# EAGLE design pc_healthypi_move_sensor_dual_v2 (EAGLE 9.6.2)
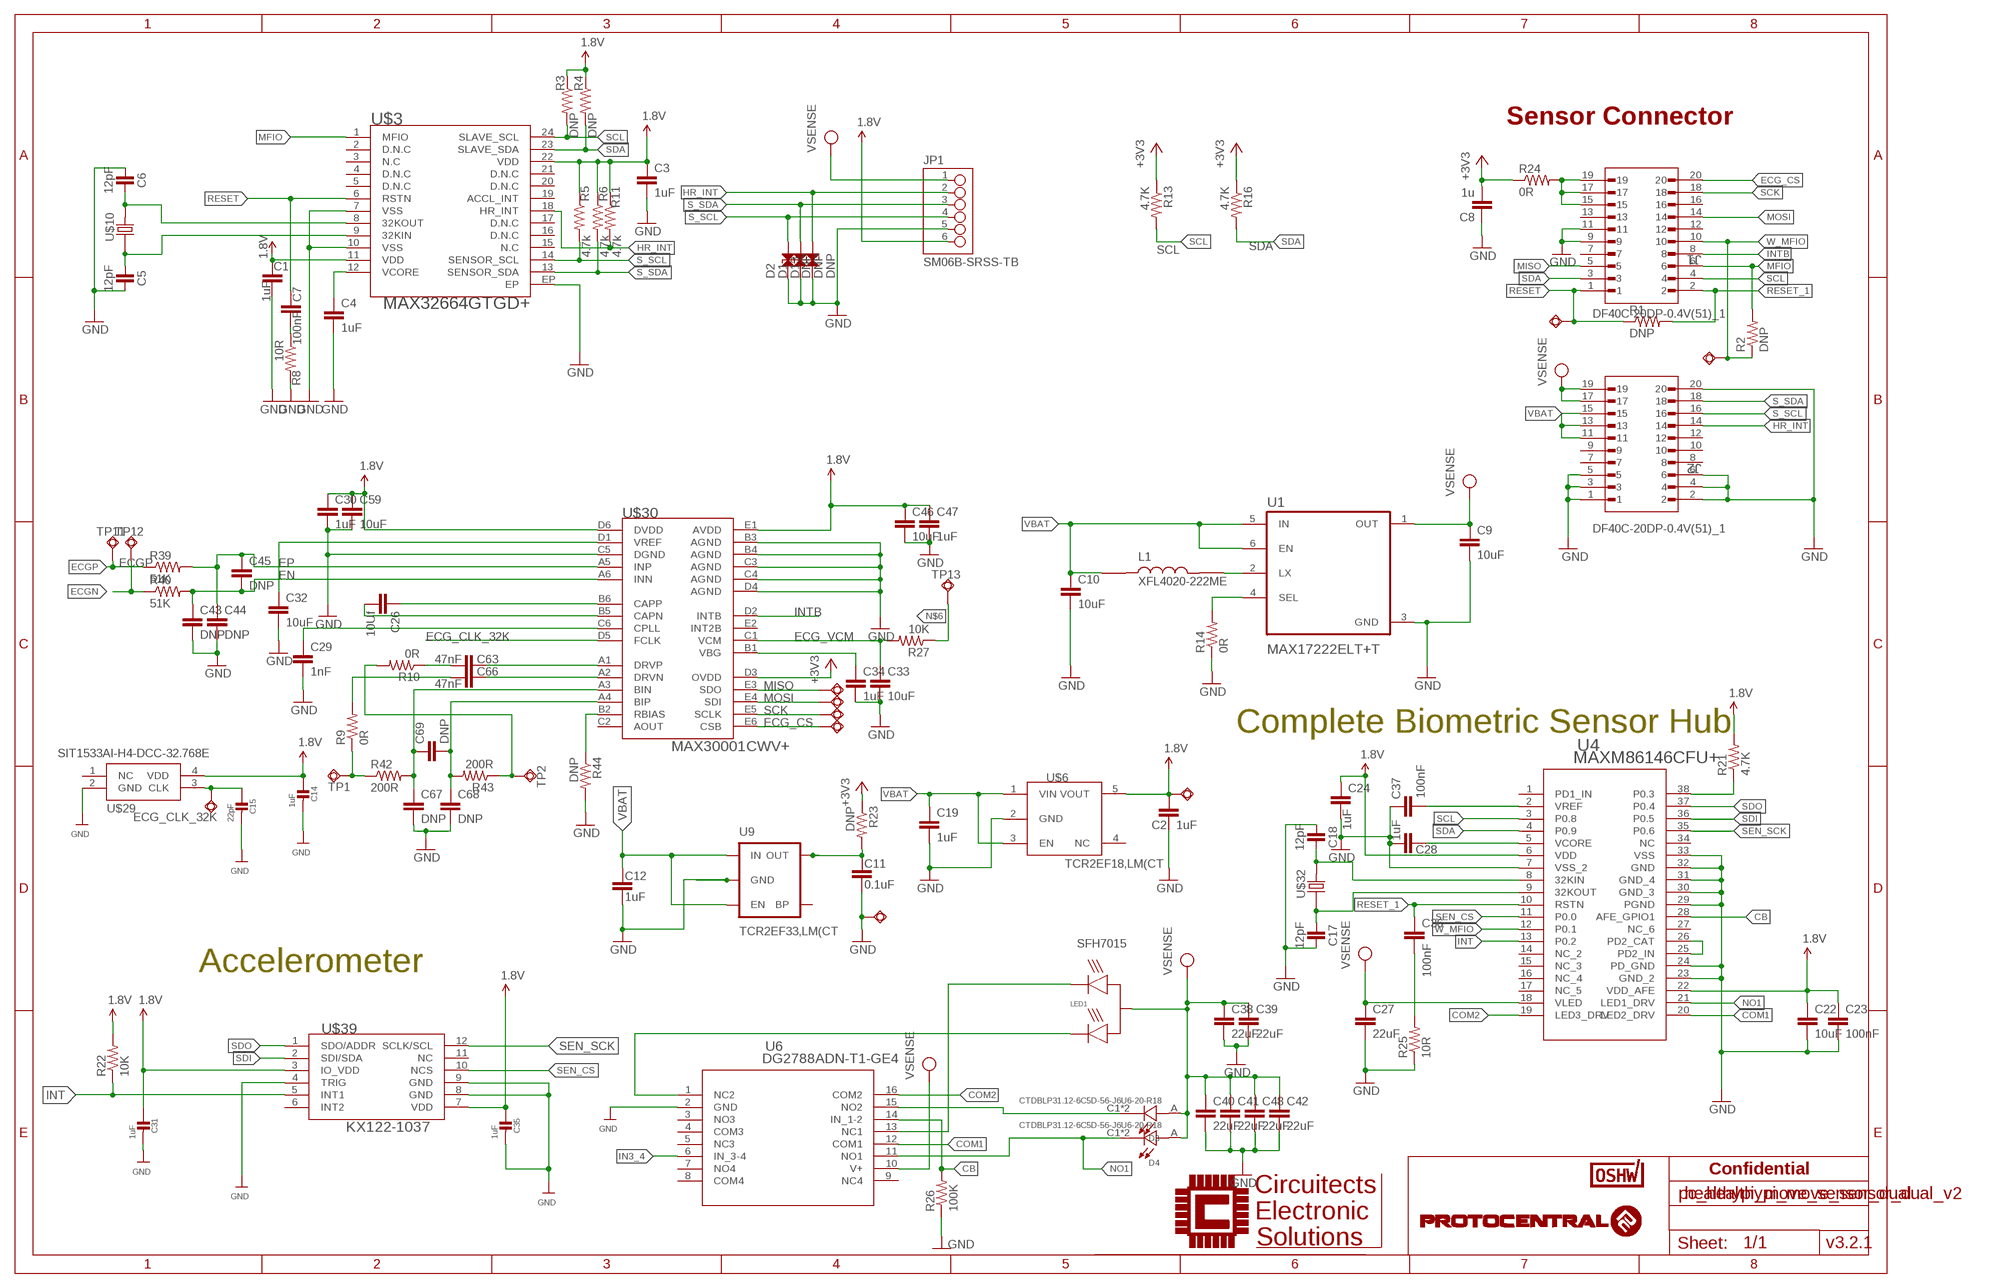
[diagram p0: schematic, sheet 1]

## Parts
C1  1uF  C-EUC0402  [C0402]
C2  1uF  C-EUC0402  [C0402]
C3  1uF  C-EUC0402  [C0402]
C4  1uF  C-EUC0402  [C0402]
C5  12pF  CAPACITORS-0402  [C0402]
C6  12pF  CAPACITORS-0402  [C0402]
C7  100nF  C-EUC0402  [C0402]
C8  1u  C-EUC0402  [C0402]
C9  10uF  C-EUC0402  [C0402]
C10  10uF  C-EUC0402  [C0402]
C11  0.1uF  0.1UF-0402-16V-10%  [0402]
C12  1uF  0.1UF-0402T-6.3V-10%-X7R  [0402-TIGHT]
C14  1uF  CAP_CERAMIC0402  [0402]
C15  22pF  CAP_CERAMIC0402  [0402]
C17  12pF  CAPACITORS-0402  [C0402]
C18  12pF  CAPACITORS-0402  [C0402]
C19  1uF  C-EUC0402  [C0402]
C22  10uF  C-EUC0402  [C0402]
C23  100nF  C-EUC0402  [C0402]
C24  1uF  C-EUC0402  [C0402]
C26  10Uf  C-EUC0402  [C0402]
C27  22uF  C-EUC0805  [C0805]
C28  1uF  C-EUC0402  [C0402]
C29  1nF  C-EUC0402  [C0402]
C30  1uF  C-EUC0402  [C0402]
C31  1uF  CAP_CERAMIC0402  [0402]
C32  10uF  C-EUC0402  [C0402]
C33  10uF  C-EUC0402  [C0402]
C34  1uF  C-EUC0402  [C0402]
C35  1uF  CAP_CERAMIC0402  [0402]
C36  100nF  C-EUC0402  [C0402]
C37  100nF  C-EUC0402  [C0402]
C38  22uF  C-EUC0805  [C0805]
C39  22uF  C-EUC0805  [C0805]
C40  22uF  C-EUC0805  [C0805]
C41  22uF  C-EUC0805  [C0805]
C42  22uF  C-EUC0805  [C0805]
C43  DNP  C-EUC0402  [C0402]
C44  DNP  C-EUC0402  [C0402]
C45  DNP  C-EUC0402  [C0402]
C46  10uF  C-EUC0402  [C0402]
C47  1uF  C-EUC0402  [C0402]
C48  22uF  C-EUC0805  [C0805]
C59  10uF  C-EUC0402  [C0402]
C63  47nF  C-EUC0402  [C0402]
C66  47nF  C-EUC0402  [C0402]
C67  DNP  C-EUC0402  [C0402]
C68  DNP  C-EUC0402  [C0402]
C69  DNP  C-EUC0402  [C0402]
D1  DNP  PESD0402-0402  [0402]
D2  DNP  PESD0402-0402  [0402]
D3  CTDBLP31.12-6C5D-56-J6U6-20-R18  [LED_CTDBLP31.12-6C5D-56-J6U6-20-R18]
D4  CTDBLP31.12-6C5D-56-J6U6-20-R18  [LED_CTDBLP31.12-6C5D-56-J6U6-20-R18]
D13  DNP  PESD0402-0402  [0402]
J1  DF40C-20DP-0.4V(51)_1  [HRS_DF40C-20DP-0.4V(51)]
J2  DF40C-20DP-0.4V(51)_1  [HRS_DF40C-20DP-0.4V(51)]
JP1  SM06B-SRSS-TB  [SM06B-SRSS-TB]
L1  XFL4020-222ME  [IND_XFL4020-222ME]
LED1  SFH7015  [SFH7015]
R1  DNP  RESISTOR0402-RES  [0402-RES]
R2  DNP  RESISTOR0402-RES  [0402-RES]
R3  DNP  RESISTOR0402-RES  [0402-RES]
R4  DNP  RESISTOR0402-RES  [0402-RES]
R5  4.7k  RESISTOR0402-RES  [0402-RES]
R6  4.7k  RESISTOR0402-RES  [0402-RES]
R8  10R  RESISTOR0402-RES  [0402-RES]
R9  0R  RESISTOR0402-RES  [0402-RES]
R10  0R  RESISTOR0402-RES  [0402-RES]
R11  4.7k  RESISTOR0402-RES  [0402-RES]
R13  4.7K  RESISTOR0402-RES  [0402-RES]
R14  0R  R-US_R0402  [R0402]
R16  4.7K  RESISTOR0402-RES  [0402-RES]
R21  4.7K  R-US_R0402  [R0402]
R22  10K  RESISTOR0402-RES  [0402-RES]
R23  DNP  RESISTOR0402-RES  [0402-RES]
R24  0R  RESISTOR0402-RES  [0402-RES]
R25  10R  R-US_R0402  [R0402]
R26  100K  R-US_R0402  [R0402]
R27  10K  R-US_R0402  [R0402]
R39  51K  RESISTOR0402-RES  [0402-RES]
R40  51K  RESISTOR0402-RES  [0402-RES]
R42  200R  RESISTOR0402-RES  [0402-RES]
R43  200R  RESISTOR0402-RES  [0402-RES]
R44  DNP  RESISTOR0402-RES  [0402-RES]
SWIO1  TPSQTP11R  [TP11R]
SWIO2  TPSQTP11R  [TP11R]
SWIO3  TPSQTP11R  [TP11R]
SWIO4  TPSQTP11R  [TP11R]
SWIO5  TPSQTP11R  [TP11R]
SWIO6  TPSQTP11R  [TP11R]
SWIO7  TPSQTP11R  [TP11R]
SWIO8  TPSQTP11R  [TP11R]
SWIO9  TPSQTP11R  [TP11R]
TP1  TPSQTP20SQ  [TP20SQ]
TP2  TPSQTP20SQ  [TP20SQ]
TP11  TPSQTP20SQ  [TP20SQ]
TP12  TPSQTP20SQ  [TP20SQ]
TP13  TPSQTP20SQ  [TP20SQ]
U1  MAX17222ELT+T  [SON65P200X200X80-6N]
U4  MAXM86146CFU+  [21-100323A_90-100112A_MXM]
U6  DG2788ADN-T1-GE4  [MINIQFN-16_VIS]
U9  TCR2EF33,LM(CT  V_REG_LDOSMD  [SOT23-5]
U$3  MAX32664GTGD+  MAX32664GTGA+  [TQFN-24L]
U$6  TCR2EF18,LM(CT  AP7354D-18W5-7  [SOT95P285X140-5N]
U$10  520-327-12.5-34B(32.768KHZ)  ECS-X-34B  [ECX-31B]
U$29  SIT1533AI-H4-DCC-32.768E  [SIT1533]
U$30  MAX30001CWV+  [30WLP]
U$32  520-327-12.5-34B(32.768KHZ)  ECS-X-34B  [ECX-31B]
U$39  KX122-1037  [KIONIX_KXTJ3-1057]
U$48  CERT-SMALL  [CERT-SMALL-SILK]

## Nets
1.8V: C1.1 C2.1 C3.1 C14.1 C22.1 C23.1 C24.1 C30.1 C31.1 C35.1 C46.1 C47.1 C59.1 JP1.6 R3.1 R4.1 R5.1 R6.1 R11.1 R21.2 R22.2 SWIO5.TP U4.6(VDD) U4.22(VDD_AFE) U$3.11(VDD) U$3.22(VDD) U$6.5(VOUT) U$29.4(VDD) U$30.D6(DVDD) U$30.E1(AVDD) U$39.3(IO_VDD) U$39.7(VDD)
+3V3: C8.2 R13.1 R16.1 R23.1 R24.1 U$30.D3(OVDD)
BIAZP: R10.2 R43.1 TP2.TP
BIOZN: R9.1 R42.1 TP1.TP
CB: R26.2 U4.28(AFE_GPIO1) U6.14(IN_1-2)
CLK_32K: C5.1 U$3.9(32KIN) U$10.P$1
CLK_32K1: C17.1 U4.9(32KOUT) U$32.P$1
COM1: U4.20(LED2_DRV) U6.12(COM1)
COM2: U4.19(LED3_DRV) U6.16(COM2)
ECG_CLK_32K: C15.1 SWIO1.TP U$29.3(CLK) U$30.D5(FCLK)
ECG_CS: J1.20 SWIO7.TP U$30.E6(CSB)
ECG_VCM: C33.1 R27.2 U$30.C1(VCM)
ECGN: R40.1 TP12.TP
ECGP: R39.1 TP11.TP
EN: C43.1 C45.2 R40.2 U$30.A6(INN)
EP: C44.1 C45.1 R39.2 U$30.A5(INP)
EXT_3V3: J1.15 J1.17 J1.19 R24.2
GND: C1.2 C2.2 C3.2 C4.2 C5.2 C6.1 C8.1 C9.2 C10.2 C11.2 C12.2 C14.2 C15.2 C17.2 C18.1 C19.2 C22.2 C23.2 C24.2 C27.2 C28.2 C29.2 C30.2 C31.2 C32.2 C33.2 C34.2 C35.2 C37.1 C38.2 C39.2 C40.2 C41.2 C42.2 C43.2 C44.2 C46.2 C47.2 C48.2 C59.2 C67.2 C68.2 D1.1 D2.1 D13.1 J1.9 J1.11 J2.1 J2.2 J2.3 J2.4 J2.5 J2.6 J2.20 JP1.5 R8.2 R14.1 R25.1 R26.1 R44.2 SWIO6.TP U1.3(GND) U4.7(VSS_2) U4.23(GND_2) U4.24(PD_GND) U4.29(PGND) U4.30(GND_3) U4.31(GND_4) U4.32(GND) U4.33(VSS) U6.2(GND) U9.2(GND) U$3.7(VSS) U$3.10(VSS) U$3.EP U$6.2(GND) U$29.2(GND) U$30.B3(AGND) U$30.B4(AGND) U$30.C3(AGND) U$30.C4(AGND) U$30.C5(DGND) U$30.D4(AGND) U$39.4(TRIG) U$39.8(GND) U$39.9(GND)
HR_INT: D13.2 J2.14 JP1.2 R11.2 U$3.18(HR_INT)
IN3_4: U6.6(IN_3-4)
INT: R22.1 U4.13(P0.2) U$39.5(INT1)
INT_3V3: C11.1 R23.2 U9.5(OUT)
INTB: J1.8 U$30.D2(INTB)
MFIO: J1.6 R2.2 U$3.1(MFIO)
MISO: J1.5 SWIO2.TP U$30.E3(SDO)
MOSI: J1.14 SWIO3.TP U$30.E4(SDI)
N$1: C4.1 U$3.12(VCORE)
N$2: C7.2 R8.1
N$3: R14.2 U1.4(SEL)
N$4: L1.2 U1.2(LX)
N$5: C18.2 U4.8(32KIN) U$32.P$2
N$6: R27.1 TP13.TP
N$8: U4.25(PD2_IN) U4.26(PD2_CAT)
N$9: C28.1 U4.5(VCORE)
N$10: R21.1 U4.38(P0.3)
N$11: C37.2 U4.2(VREF)
N$12: C36.2 R25.2
N$18: C66.1 R9.2
N$19: C63.1 R10.1
N$21: LED1.4(IRC) U6.13(NC1)
N$23: LED1.2(RC) U6.1(NC2)
N$25: C6.2 U$3.8(32KOUT) U$10.P$2
N$26: D3.C1(C) D3.C2(C) U6.15(NO2)
N$53: C29.1 U$30.C6(CPLL)
N$55: C26.2 U$30.B5(CAPN)
N$56: C32.1 U$30.D1(VREF)
N$57: C34.1 U$30.B1(VBG)
N$60: C26.1 U$30.B6(CAPP)
N$61: C63.2 U$30.A1(DRVP)
N$62: C66.2 U$30.A2(DRVN)
N$63: C67.1 C69.1 R42.2 U$30.A3(BIN)
N$64: C68.1 C69.2 R43.2 U$30.A4(BIP)
N$65: R44.1 U$30.B2(RBIAS)
NO1: D4.C1(C) D4.C2(C) U4.21(LED1_DRV) U6.11(NO1)
RESET: C7.1 J1.1 R1.1 SWIO8.TP U$3.6(RSTN)
RESET_1: C36.1 J1.2 R1.2 U4.10(RSTN)
S_SCL: D2.2 J2.16 JP1.4 R5.2 U$3.14(SENSOR_SCL)
S_SDA: D1.2 J2.18 JP1.3 R6.2 U$3.13(SENSOR_SDA)
SCK: J1.18 SWIO4.TP U$30.E5(SCLK)
SCL: J1.4 R3.2 R13.2 U4.3(P0.8) U$3.24(SLAVE_SCL)
SDA: J1.3 R4.2 R16.2 U4.4(P0.9) U$3.23(SLAVE_SDA)
SDI: U4.36(P0.5) U$39.2(SDI/SDA)
SDO: U4.37(P0.4) U$39.1(SDO/ADDR)
SEN_CS: U4.11(P0.0) U$39.10(NCS)
SEN_SCK: U4.35(P0.6) U$39.12(SCLK/SCL)
VBAT: C10.1 C12.1 C19.1 J2.11 J2.13 J2.15 L1.1 U1.5(IN) U1.6(EN) U9.1(IN) U9.3(EN) U$6.1(VIN) U$6.3(EN)
VPP: C9.1 C27.1 C38.1 C39.1 C40.1 C41.1 C42.1 C48.1 D3.A D4.A J2.17 J2.19 JP1.1 LED1.3(A) U1.1(OUT) U4.18(VLED) U6.10(V+) ; supply symbol labelled VSENSE
W_MFIO: J1.10 R2.1 SWIO9.TP U4.12(P0.1)
Unconnected: J1.7 J1.12 J1.13 J1.16 J2.7 J2.8 J2.9 J2.10 J2.12 U4.1(PD1_IN) U4.14(NC_2) U4.15(NC_3) U4.16(NC_4) U4.17(NC_5) U4.27(NC_6) U4.34(NC) U6.3(NO3) U6.4(COM3) U6.5(NC3) U6.7(NO4) U6.8(COM4) U6.9(NC4) U9.4(BP) U$3.2(D.N.C) U$3.3(N.C) U$3.4(D.N.C) U$3.5(D.N.C) U$3.15(N.C) U$3.16(D.N.C) U$3.17(D.N.C) U$3.19(ACCL_INT) U$3.20(D.N.C) U$3.21(D.N.C) U$6.4(NC) U$29.1(NC) U$30.C2(AOUT) U$30.E2(INT2B) U$39.6(INT2) U$39.11(NC)

## Notes on the sheet
- Sensor Connector
- Complete Biometric Sensor Hub
- SFH7015
- Accelerometer
- Confidential
- healthypi_move_sensor_dual
- v3.2.1

## Library data of the parts
C1-C4 C7-C10 C19 C22-C24 C26-C30 C32-C34 C36-C48 C59 C63 C66-C69 = rcl:C-EU: CAPACITOR, European symbol; SPICEPREFIX: C
C5 C6 C17 C18 = Arduino:CAPACITORS: Capacitors ...4.7uF @ 6.3V -> 0402 ...10uF @ 16V -> 0603 ...22uF @ 25V -> 0805
C11 = SparkFun-Capacitors:0.1UF: 0.1µF ceramic capacitors A capacitor is a passive two-terminal electrical component used to store electrical energy temporarily in an electric field.; PROD_ID: CAP-12416
C12 = SparkFun-Capacitors:0.1UF: 0.1µF ceramic capacitors A capacitor is a passive two-terminal electrical component used to store electrical energy temporarily in an electric field.; PROD_ID: CAP-14993; VALUE: 0.1uF
C14 C15 C31 C35 = microbuilder:CAP_CERAMIC: Ceramic Capacitors 0402 - 0402 Surface Mount Capacitors 16pF 50V 5% [Digikey: 445-4899-2-ND] 18pF 50V 5% [Digikey: 490-1281-2-ND] 22pF 50V 5% [Digikey: 490-1283-2-ND] 68pF 50V 5% [Digikey: 490-1289-2-ND] 0.1uF 10V 10% [Digikey: 490-1318-2-ND] 1.0uF 6.3V 10% [Digikey: 490-1320-2-ND] 0603 - 0603 Surface Mount Capacitors 16 pF 50V 5% [Digikey: 445-5051-2-ND] 22 pF 50V [Digikey: PCC220ACVTR-ND] 33 pF 50V 5% [Digikey: 490-1415-1-ND] 56pF 50V 5% [Digikey: 490-1421-1-ND] 220pF 50V 5% [Digikey: 445-1285-1-ND] 680 pF 50V 2200 pF 50V 5% C0G [Digikey: 445-1297-1-ND] 5600 pF 100V 5% X7R [Digikey: 478-3711-1-ND] 0.1 µF 25V 10% [Digikey: PCC2277TR-ND] 0.22 µF 16V 10% X7R [Digikey: 445-1318-1-ND] 1.0 µF 25V 10% [Digikey: 445-5146-2-ND] 0603 - RF Specific 3pF 250V +/-0.1pF RF [Digikey: 712-1347-1-ND] 18 pF 250V 5% [Digikey: 478-3505-1-ND or 712-1322-1-ND] 56 pF 250V 5% C0G RF [Digikey: 490-4867-1-ND] 68 pF 250V RF [Digikey: 490-4868-1-ND] 0805 - 0805 Surface Mount Capacitors 220 pF 250V 2% RF Ceramic Capacitor [Digikey: 712-1398-1-ND] 1000 pF 50V 2% NP0 Ceramic Capacitor [Digikey: 478-3760-1-ND] 0.1 µF 25V 10% Ceramic Capacitor [Digikey: PCC1828TR-ND] 1.0 µF 16V 10% Ceramic Capacitor[Digikey: 490-1691-2-ND] 10.0 µF 10V 10% Ceramic Capacitor[Digikey: 709-1228-1-ND] 10.0 uF 16V 10% Ceramic Capacitor [Digikey: 478-5165-2-ND] 47 uF 6.3V 20% Ceramic Capacitor [Digikey: 587-1779-1-ND or 399-5506-1-ND] 1206 - 1206 Surface Mount Capacitors 47uF 10V 20% Ceramic Capacitor [Digikey: 490-5528-1-ND or 399-5508-1-ND or 445-6010-1-ND]
D1 D2 D13 = SparkFun-DiscreteSemi:PESD0402: ESD protection diode PESD is used to protect a signal line from ESD.; DIGIKEY_PART: PESD0402-140CT-ND; MOUSE_PART: 650-PESD0402-140; PROD_ID: DIO-15359
D3 D4 = circuitects:CTDBLP31.12-6C5D-56-J6U6-20-R18: Standard LEDs - SMD Green 536nm Firefly E2218 Check availability <https://pricing.snapeda.com/parts/CT%20DBLP31.12-6C5D-56-J6U6-20-R18/OSRAM%20Opto%20Semiconductors/view-part?ref=eda>; AVAILABILITY: In Stock; DESCRIPTION: Standard LEDs - SMD Green 536nm Firefly E2218; MF: OSRAM Opto Semiconductors; MP: CT DBLP31.12-6C5D-56-J6U6-20-R18; PACKAGE: None; PRICE: None; PURCHASE-URL: https://pricing.snapeda.com/search/part/CT DBLP31.12-6C5D-56-J6U6-20-R18/?ref=eda
J1 J2 = circuitects:DF40C-20DP-0.4V(51)_1; MANUFACTURER: Hirose Electric; MAXIMUM_PACKAGE_HEIGHT: 1.29mm; PARTREV: 02/2020; STANDARD: Manufacturer Recommendations
JP1 = circuitects:SM06B-SRSS-TB: Check availability <https://pricing.snapeda.com/parts/SM06B-SRSS-TB/JST%20Sales/view-part?ref=eda>; AVAILABILITY: In Stock; CHECK_PRICES: https://www.snapeda.com/parts/SM06B-SRSS-TB/JST+Sales+America+Inc./view-part/?ref=eda; DESCRIPTION: Connector Header Surface Mount, Right Angle 6 position 0.039 (1.00mm); MF: JST Sales; MP: SM06B-SRSS-TB; PACKAGE: None; PRICE: None; PURCHASE-URL: https://www.snapeda.com/api/url_track_click_mouser/?unipart_id=555083&manufacturer=JST Sales&part_name=SM06B-SRSS-TB&search_term=sm06b-srss-tb; SNAPEDA_LINK: https://www.snapeda.com/parts/SM06B-SRSS-TB/JST+Sales+America+Inc./view-part/?ref=snap
L1 = circuitects:XFL4020-222ME: Power inductor, shielded, 20% tol, SMT, RoHS, halogen free Check availability <https://pricing.snapeda.com/parts/XFL4020-222ME/Coilcraft/view-part?ref=eda>; AVAILABILITY: In Stock; CHECK_PRICES: https://www.snapeda.com/parts/XFL4020-222ME/Coilcraft/view-part/?ref=eda; DESCRIPTION: Power inductor, shielded, 20% tol, SMT, RoHS, halogen free; MF: Coilcraft; MP: XFL4020-222ME; PACKAGE: None; PRICE: None; SNAPEDA_LINK: https://www.snapeda.com/parts/XFL4020-222ME/Coilcraft/view-part/?ref=snap
LED1 = circuitects:SFH7015: Check availability <https://pricing.snapeda.com/parts/SFH%207015/OSRAM%20Opto%20Semiconductors/view-part?ref=eda>; AVAILABILITY: In Stock; DESCRIPTION: Infrared (IR) Emitter 950nm 1.3V 60mA 1.65mW/sr @ 20mA 120° 4-SMD, No Lead; MF: OSRAM Opto Semiconductors; MP: SFH 7015; PACKAGE: None; PRICE: None; PURCHASE-URL: https://pricing.snapeda.com/search/part/SFH 7015/?ref=eda
R1-R6 R8-R11 R13 R16 R22-R24 R39 R40 R42-R44 = SparkFun:RESISTOR: Resistor Basic schematic elements and footprints for 0603, 1206, and PTH resistors.
R14 R21 R25-R27 = rcl:R-US_: RESISTOR, American symbol; SPICEPREFIX: R
SWIO1-SWIO9 TP1 TP2 TP11-TP13 = testpad:TPSQ: Test pad
U1 = circuitects:MAX17222ELT+T: Check availability <https://pricing.snapeda.com/parts/MAX17222ELT%2BT/Analog%20Devices/view-part?ref=eda>; AVAILABILITY: In Stock; CHECK_PRICES: https://www.snapeda.com/parts/MAX17222ELT+T/Analog+Devices/view-part/?ref=eda; DESCRIPTION: 400mV to 5.5V Input, nanoPower Synchronous Boost Converter with True Shutdown; MF: Analog Devices; MP: MAX17222ELT+T; PACKAGE: uDFN-6 Maxim; PRICE: None; PURCHASE-URL: https://www.snapeda.com/api/url_track_click_mouser/?unipart_id=2779660&manufacturer=Analog Devices&part_name=MAX17222ELT+T&search_term= max17222elt+t; SNAPEDA_LINK: https://www.snapeda.com/parts/MAX17222ELT+T/Analog+Devices/view-part/?ref=snap
U4 = circuitects:MAXM86146CFU+; COPYRIGHT: Copyright (C) 2023 Ultra Librarian. All rights reserved.; MANUFACTURER_PART_NUMBER: MAXM86146CFU+; MFR_NAME: Analog Devices / Maxim Integrated
U6 = circuitects:DG2788ADN-T1-GE4; COPYRIGHT: Copyright (C) 2023 Ultra Librarian. All rights reserved.; MANUFACTURER_PART_NUMBER: DG2788ADN-T1-GE4; MFR_NAME: Vishay
U9 = SparkFun-PowerIC:V_REG_LDO: Voltage Regulator LDO Standard 150mA LDO voltage regulator in SOT-23 layout. Micrel part MIC5205. BP (by-pass) pin is used to lower output noise with 470pF cap.; PROD_ID: VREG-12457
U$3 = circuitects:MAX32664GTGA+
U$6 = circuitects:AP7354D-18W5-7
U$10 U$32 = circuitects:ECS-X-34B
U$29 = circuitects:SIT1533AI-H4-DCC-32.768E
U$30 = circuitects:MAX30001CWV+
U$39 = KIONIX_KXTJ3-1057:KX122-1037
U$48 = OSHWA:CERT

## Net classes
2 Clock: width 0.089 mm, clearance 0.178 mm

## Board
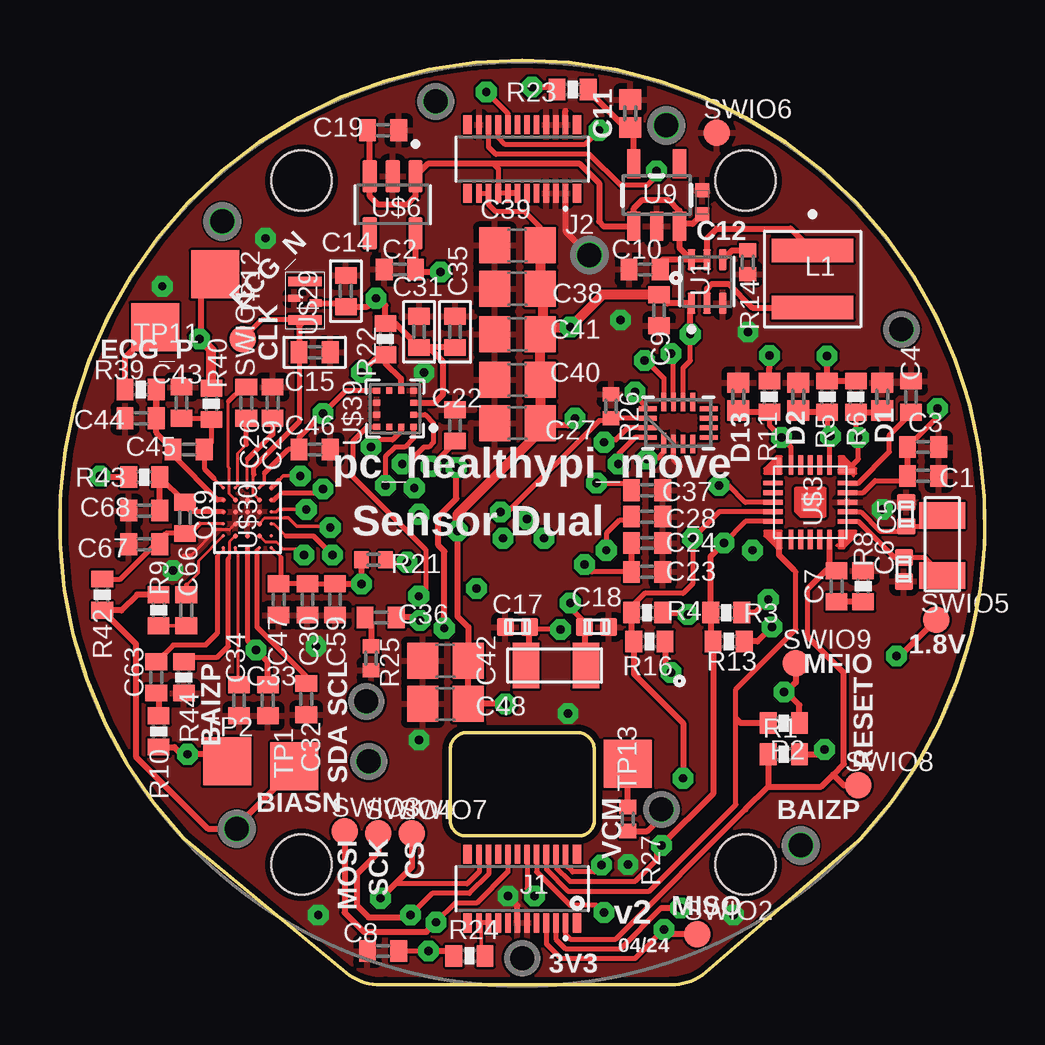
[diagram p1: board, top side]
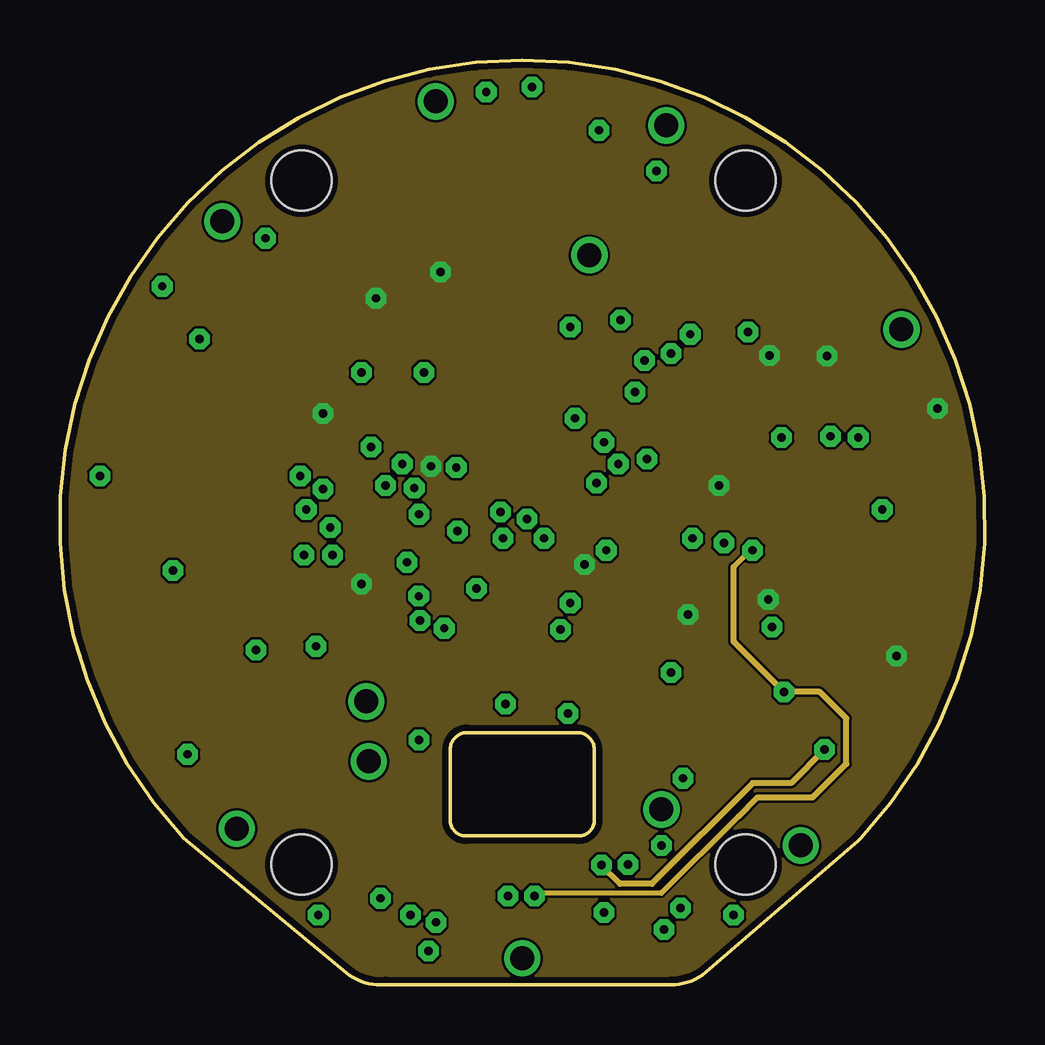
[diagram p2: board, inner layer Route2]
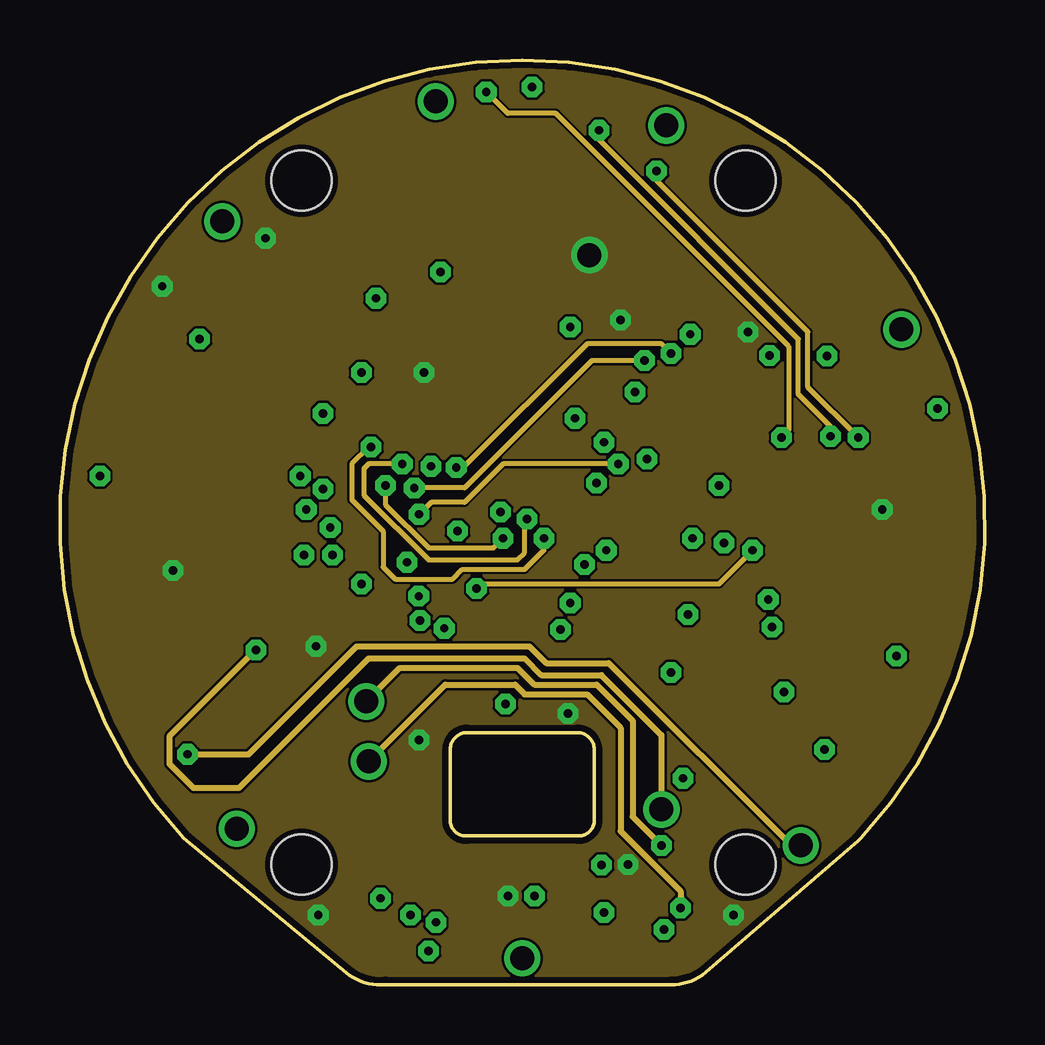
[diagram p3: board, inner layer Route15]
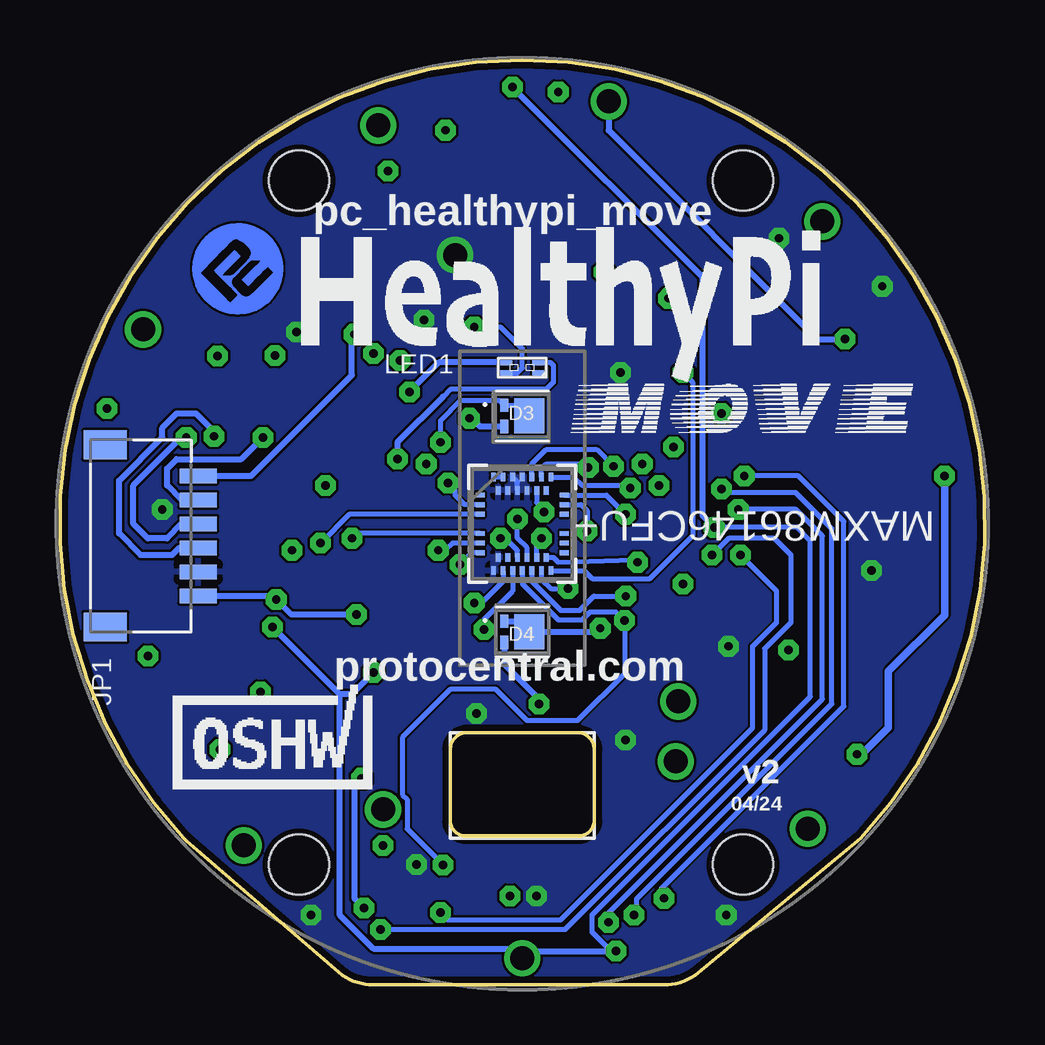
[diagram p4: board, bottom side, seen from below]

Size 38.52 x 38.54 mm. Coordinates in mm from the lower left corner, seen from the top.
Outline: 13.56,0.01 25.46,0.01 arc37 26.76,0.41 33.26,6.01 arc4 33.36,6.11 arc266 5.16,6.11 12.06,0.41 arc42 13.56,0.01
Outline: 16.96,10.51 21.56,10.51 arc-90 22.26,9.81 22.26,6.81 arc-90 21.56,6.21 16.96,6.21 arc-90 16.26,6.81 16.26,9.81 arc-90 16.96,10.51
Copper layers (1+2*15+16): Top 0.035mm / dielectric 0.26mm / Route2 0.035mm / dielectric 0.2mm / Route15 0.035mm / dielectric 0.2mm / Bottom 0.035mm
Design rules "Circuitects-Rules *": minimum track width 3mil, minimum drill 0.3mm, track to track 4mil, track to pad 4mil, pad to pad 6mil, via to via 6mil, smd to smd 4mil, copper to edge 10mil, drill to drill 8mil, minimum pad ring 12mil, minimum via ring 10mil, stop-mask expansion 4mil, vias tented up to drill 25mil, thermal gap 10mil
Holes 2.5 mm at 10.06,33.51 28.56,33.51 10.06,5.01 28.56,5.01

### Footprints (pad centres in the part's own frame; a part is rotated, then mirrored left to right if it is on the bottom)
C0402 = smd 0.7 x 0.9: 1 -0.65,0; 2 0.65,0
C0402' = smd 0.75 x 0.7: 1 0,0.5; 2 0,-0.5
0402 = smd 0.85 x 0.9: 1 -0.58,0; 2 0.58,0
0402-TIGHT = smd 0.6 x 0.6: 1 -0.5,0; 2 0.5,0
0402' = smd 0.7 x 0.9: 1 -0.65,0; 2 0.65,0
C0805 = smd 1.3 x 1.5: 1 -0.95,0; 2 0.95,0
LED_CTDBLP31.12-6C5D-56-J6U6-20-R18 = smd 0.35 x 0.55: A -0.75,-0.445; C1 -0.75,0.445 | smd 1.25 x 1.45: C2 0.3,0
HRS_DF40C-20DP-0.4V(51) = smd 0.23 x 0.8: 1 -1.8,1.43; 2 -1.8,-1.43; 3 -1.4,1.43; 4 -1.4,-1.43; 5 -1,1.43; 6 -1,-1.43; 7 -0.6,1.43; 8 -0.6,-1.43; 9 -0.2,1.43; 10 -0.2,-1.43; 11 0.2,1.43; 12 0.2,-1.43; 13 0.6,1.43; 14 0.6,-1.43; 15 1,1.43; 16 1,-1.43; 17 1.4,1.43; 18 1.4,-1.43; 19 1.8,1.43; 20 1.8,-1.43 | smd 0.35 x 0.8: S1 -2.275,1.43; S2 -2.275,-1.43; S3 2.275,1.43; S4 2.275,-1.43
SM06B-SRSS-TB = smd 0.6 x 1.55: 1 -2.5,0; 2 -1.5,0; 3 -0.5,0; 4 0.5,0; 5 1.5,0; 6 2.5,0 | smd 1.2 x 1.8: P-MOUNT1 -3.8,-3.875; P-MOUNT2 3.8,-3.875
IND_XFL4020-222ME = smd 0.98 x 3.4: 1 -1.185,0; 2 1.185,0
SFH7015 = smd 0.5 x 0.25: 1 0.675,-0.225; 2 0.675,0.225; 3 -0.675,-0.225; 4 -0.675,0.225
0402-RES = smd 0.7 x 0.9: 1 -0.65,0; 2 0.65,0
R0402 = smd 0.6 x 0.7: 1 -0.5,0; 2 0.5,0
TP11R = smd 1.1 x 1.1: TP 0,0
TP20SQ = smd 2 x 2: TP 0,0
SON65P200X200X80-6N = smd 0.88 x 0.32: 1 -0.91,0.65; 2 -0.91,0; 3 -0.91,-0.65; 4 0.91,-0.65; 5 0.91,0; 6 0.91,0.65
21-100323A_90-100112A_MXM = smd 0.356 x 0.2: 1 -1.75,1.2; 2 -1.75,0.8; 3 -1.75,0.4; 4 -1.75,-0.4; 5 -1.75,-0.8; 6 -1.75,-1.2; 14 1.75,-1.2; 15 1.75,-0.8; 16 1.75,-0.4; 17 1.75,0.4; 18 1.75,0.8; 19 1.75,1.2 | smd 0.2 x 0.356: 7 -1.2,-1.95; 8 -0.8,-1.95; 9 -0.4,-1.95; 10 0,-1.95; 11 0.4,-1.95; 12 0.8,-1.95; 13 1.2,-1.95; 20 1.2,1.95; 21 0.8,1.95; 22 0.4,1.95; 23 0,1.95; 24 -0.4,1.95; 25 -0.8,1.95; 26 -1.2,1.95; 27 1,1.395; 28 0.6,1.395; 29 0.2,1.395; 30 -0.2,1.395; 31 -0.6,1.395; 32 -1,1.395; 33 -1,-1.395; 34 -0.6,-1.395; 35 -0.2,-1.395; 36 0.2,-1.395; 37 0.6,-1.395; 38 1,-1.395
MINIQFN-16_VIS = smd 0.864 x 0.203: 1 -0.826,0.6 | smd 0.762 x 0.203: 2 -0.876,0.2; 3 -0.876,-0.2; 4 -0.876,-0.6; 9 0.876,-0.6; 10 0.876,-0.2; 11 0.876,0.2; 12 0.876,0.6 | smd 0.203 x 0.762: 5 -0.6,-1.27; 6 -0.2,-1.27; 7 0.2,-1.27; 8 0.6,-1.27; 13 0.6,1.27; 14 0.2,1.27; 15 -0.2,1.27; 16 -0.6,1.27
SOT23-5 = smd 0.55 x 1.2: 1 -0.95,-1.3; 2 0,-1.3; 3 0.95,-1.3; 4 0.95,1.3; 5 -0.95,1.3
TQFN-24L = smd 0.7 x 0.2: 1 -1.6,1.3; 7 -1.5,-1.3; 19 1.5,1.3 | smd 0.8 x 0.2: 2 -1.55,0.8; 3 -1.55,0.4; 4 -1.55,0; 5 -1.55,-0.4; 6 -1.55,-0.8; 14 1.55,-0.8; 15 1.55,-0.4; 16 1.55,0; 17 1.55,0.4; 18 1.55,0.8 | smd 0.2 x 0.8: 8 -0.8,-1.55; 9 -0.4,-1.55; 10 0,-1.55; 11 0.4,-1.55; 12 0.8,-1.55; 20 0.8,1.55; 21 0.4,1.55; 22 0,1.55; 23 -0.4,1.55; 24 -0.8,1.55 | smd 0.2 x 0.7: 13 1.3,-1.5 | smd 0.7 x 0.7: EP 0,0
SOT95P285X140-5N = smd 1.35 x 0.6: 1 -1.185,0.95; 2 -1.185,0; 3 -1.185,-0.95; 4 1.185,-0.95; 5 1.185,0.95
ECX-31B = smd 1.1 x 1.9: P$1 1.25,0; P$2 -1.25,0
SIT1533 = smd 0.4 x 1.4: 1 -0.8,0; 3 0.8,0 | smd 0.3 x 0.5: 2 -0.1,-0.45; 4 0.1,0.45
30WLP = smd 0.15 x 0.15: A1 -1.25,1; A2 -0.75,1; A3 -0.25,1; A4 0.25,1; A5 0.75,1; A6 1.25,1; B1 -1.25,0.5; B6 1.25,0.5; C1 -1.25,0; C6 1.25,0; D1 -1.25,-0.5; D6 1.25,-0.5; E1 -1.25,-1; E2 -0.75,-1; E3 -0.25,-1; E4 0.25,-1; E5 0.75,-1; E6 1.25,-1 | smd 0.2 x 0.2: B2 -0.75,0.5; B3 -0.25,0.5; B4 0.25,0.5; B5 0.75,0.5; C2 -0.75,0; C3 -0.25,0; C4 0.25,0; C5 0.75,0; D2 -0.75,-0.5; D3 -0.25,-0.5; D4 0.25,-0.5; D5 0.75,-0.5
KIONIX_KXTJ3-1057 = smd 0.275 x 0.25: 1 -0.762,0.75; 2 -0.762,0.25; 3 -0.762,-0.25; 4 -0.762,-0.75; 7 0.762,-0.75; 8 0.762,-0.25; 9 0.762,0.25; 10 0.762,0.75 | smd 0.25 x 0.275: 5 -0.25,-0.762; 6 0.25,-0.762; 11 0.25,0.762; 12 -0.25,0.762

### Placement (x,y rotation side)
C1  35.96,21.21 0 top
C2  14.16,29.81 180 top
C3  35.96,22.41 0 top
C4  35.46,24.51 90 top
C5  12pF  [C0402']  35.26,19.61 180 top
C6  12pF  [C0402']  35.16,17.31 180 top
C7  32.36,16.61 270 top
C8  13.46,1.41 0 top
C9  24.96,28.11 270 top
C10  24.36,29.81 180 top
C11  23.76,36.31 90 top
C12  26.76,32.61 90 top
C14  1uF  [0402']  11.91,28.91 90 top
C15  22pF  [0402']  10.61,26.36 0 top
C17  12pF  [C0402']  19.06,14.91 270 top
C18  12pF  [C0402']  22.36,14.91 270 top
C19  13.46,35.61 0 top
C22  16.46,23.31 90 top
C23  24.46,17.21 0 top
C24  24.46,18.41 0 top
C26  7.76,24.26 90 top
C27  19.06,23.41 180 top
C28  24.46,19.51 0 top
C29  8.86,24.26 90 top
C30  10.31,16.06 270 top
C31  1uF  [0402']  14.96,27.21 90 top
C32  10.26,11.91 270 top
C33  8.66,11.86 270 top
C34  7.46,11.86 270 top
C35  1uF  [0402']  16.46,27.21 90 top
C36  13.36,15.31 180 top
C37  24.46,20.61 180 top
C38  19.06,29.01 180 top
C39  19.06,30.81 180 top
C40  19.06,25.21 180 top
C41  19.06,27.11 180 top
C42  16.06,13.51 180 top
C43  5.06,24.26 90 top
C44  3.36,23.61 180 top
C45  5.36,22.31 0 top
C46  10.61,22.31 0 top
C47  9.11,16.06 270 top
C48  16.06,11.71 180 top
C59  11.46,16.06 270 top
C63  4.01,12.81 90 top
C66  5.26,15.61 90 top
C67  3.51,18.36 180 top
C68  3.51,19.76 180 top
C69  5.21,19.46 90 top
D1  34.26,24.51 270 top
D2  30.76,24.51 270 top
D3  19.26,23.71 0 bottom
D4  19.26,14.71 0 bottom
D13  28.26,24.51 270 top
J1  19.26,4.01 180 top
J2  19.26,34.41 180 top
JP1  32.76,18.71 270 bottom
L1  31.36,29.41 270 top
LED1  19.26,25.71 0 bottom
R1  30.16,9.61 0 top
R2  30.16,10.91 180 top
R3  27.76,15.51 180 top
R4  24.46,15.51 180 top
R5  31.96,24.51 270 top
R6  33.16,24.51 270 top
R8  33.46,16.61 90 top
R9  4.11,15.61 270 top
R10  4.11,10.56 270 top
R11  29.56,24.51 270 top
R13  27.86,14.31 180 top
R14  28.66,30.11 90 top
R16  24.56,14.31 180 top
R21  13.06,17.71 180 top
R22  13.56,26.91 90 top
R23  21.36,37.31 0 top
R24  17.06,1.21 0 top
R25  12.96,13.61 90 top
R26  22.96,24.11 270 top
R27  23.66,6.91 270 top
R39  3.36,24.81 0 top
R40  6.31,24.21 270 top
R42  1.76,16.26 90 top
R43  3.51,21.16 0 top
R44  5.16,12.81 270 top
SWIO1  7.61,26.91 270 top
SWIO2  26.56,2.11 0 top
SWIO3  11.86,6.41 0 top
SWIO4  13.26,6.31 0 top
SWIO5  36.51,15.21 0 top
SWIO6  27.36,35.51 0 top
SWIO7  14.66,6.31 0 top
SWIO8  33.26,8.31 0 top
SWIO9  30.66,13.41 0 top
TP1  9.76,9.11 0 top
TP2  6.96,9.31 0 top
TP11  3.96,27.41 270 top
TP12  6.46,29.61 270 top
TP13  23.66,9.21 270 top
U1  26.96,29.31 90 top
U4  19.26,19.21 0 bottom
U6  25.76,23.41 90 top
U9  24.86,32.91 0 top
U$3  31.26,20.11 90 top
U$6  13.86,32.51 270 top
U$10  36.76,18.31 90 top
U$23  [HEALTHYPI_MOVE_LOGO_1]  18.06,20.41 0 bottom
U$24  [HEALTHYPI_MOVE_LOGO]  28.46,21.81 0 bottom
U$29  10.21,28.51 270 top
U$30  7.81,19.46 90 top
U$32  20.66,13.31 180 top
U$39  13.96,24.01 180 top
U$48  29.66,8.16 0 bottom
U$52  [PCROUNDLOGO_GOLD]  28.86,27.01 90 bottom

### Tracks (layer width: path | path; a pad name or v marks a point on that pad's centre or on a via)
1.8V  (via drill 0.35)
  Top 0.127: U$30.E1 9.21,17.81
  Top 0.152: U$30.D6 8.51,20.91 8.51,21.31
  Top 0.2: 8.51,21.31 9.51,22.31 C46.1 9.96,22.81 v10.96,23.81 11.91,24.76 U$39.7 | 9.21,17.81 9.21,16.81 C47.1 C30.1 C59.1 | U$3.11 33.46,20.51 33.96,21.01 35.11,21.01 C1.1 | U$3.22 28.56,20.11 27.86,20.81 v27.46,20.81 | C22.1 16.46,22.61 v15.46,21.61 | v21.86,17.51 22.16,17.21 23.51,17.21 23.81,17.51 C24.1 | C3.1 36.66,23.76 36.66,23.91 v36.56,24.01
  Top 0.254: U$6.5 C2.1 14.91,29.71 v15.86,29.71 | U$29.4 11.76,28.41 C14.1 12.81,28.26 v13.16,28.61 13.26,28.61 13.56,28.31 R22.2 13.96,27.56 C31.1 | U$39.3 15.61,24.26 15.96,24.61 15.96,25.96 15.36,26.56 C31.1 | C35.1 C31.1 | R6.1 R5.1 v31.96,26.21 | R11.1 29.56,25.71 29.56,25.72 v29.56,26.22 | C3.1 C1.1 | C24.1 C23.1 | 11.56,16.71 C59.1 12.46,16.71 12.51,16.76 | R21.2 12.56,16.91 12.46,16.81 12.51,16.76 | 12.51,16.76 v12.56,16.71 | v29.51,16.06 28.96,15.51 R3.1 | R4.1 26.08,15.51 v26.16,15.43 | SWIO5.TP 35.01,13.71 v34.86,13.71
  Bottom 0.2: U4.22 18.86,21.71 18.26,22.31 16.16,22.31 v15.46,21.61 | U4.6 21.36,18.01 v21.86,17.51
  Bottom 0.254: v26.16,15.43 28.88,15.43 v29.51,16.06 29.66,16.21 JP1.6
  pour Route2: 38.66,38.91 -0.04,38.91 -0.04,-0.09 38.66,-0.09
+3V3  (via drill 0.35, 1)
  Top 0.127: U$30.D3 8.53,19.46 9.34,19.46
  Top 0.152: 9.34,19.46 9.51,19.46 9.86,19.11 11.21,19.11 v11.26,19.06
  Top 0.2: v15.36,1.41 C8.2
  Top 0.254: R23.1 20.61,37.41 v19.67,37.41 | R24.1 16.21,1.41 v15.36,1.41 | v29.66,14.91 29.06,14.31 R13.1 | R16.1 25.21,13.26 v25.46,13.01
  Bottom 0.2: v15.36,1.41 15.56,1.41 16.36,2.21 16.36,2.91 7.26,12.01 7.26,18.51 7.81,19.06 v11.26,19.06
  Bottom 0.254: v15.36,1.41 18.96,1.41 v19.26,1.11 19.66,1.51 25.46,1.51 26.86,2.91 26.86,12.11 | v19.67,37.41 11.76,29.5 11.76,19.56 v11.26,19.06 | 26.86,12.11 v29.66,14.91 | v25.46,13.01 26.36,12.11 26.86,12.11
BIAZP  (via drill 0.35, 1)
  Top 0.254: 2.81,21.16 R43.1 1.71,21.16 v1.66,21.21 | R10.2 4.76,9.91 5.06,9.61 v5.31,9.61 6.66,9.61 TP2.TP
  Route15 0.254: v5.31,9.61 7.86,9.61 12.36,14.11 19.56,14.11 20.26,13.41 22.86,13.41 30.46,5.81 v30.86,5.81
  Bottom 0.305: v1.66,21.21 1.66,15.41 4.01,13.06 4.01,10.71 5.11,9.61 v5.31,9.61
BIOZN  (via drill 1)
  Top 0.254: R9.1 3.21,16.26 2.56,15.61 R42.1 3.16,14.21 3.16,9.51 6.16,6.51 7.26,6.51 | 9.76,8.61 TP1.TP 9.76,9.01 7.26,6.51 | 7.26,6.51 v7.36,6.51
CB  (via drill 0.35)
  Top 0.2: U6.14 R26.2 22.86,23.51 22.46,23.51 18.66,19.71 v18.36,19.71
  Bottom 0.2: U4.28 18.66,20.11 18.36,19.81 v18.36,19.71
CLK_32K
  Top 0.2: U$3.9 33.36,19.71 34.16,18.91 35.06,18.91 C5.1 36.31,19.11 U$10.P$1
CLK_32K1  (via drill 0.35)
  Top 0.2: v20.86,14.81 19.66,14.81 C17.1
  Top 0.254: C17.1 19.56,13.46 U$32.P$1
  Bottom 0.2: U4.9 19.66,16.41 20.86,15.21 v20.86,14.81
COM1  (via drill 0.35)
  Top 0.2: U6.12 25.16,25.29 24.44,26.01 v24.36,26.01
  Route15 0.2: v24.36,26.01 22.16,26.01 16.86,20.71 v14.76,20.71
  Bottom 0.2: U4.20 17.11,21.16 16.76,20.81 14.86,20.81 v14.76,20.71
COM2  (via drill 0.35)
  Top 0.2: U6.16 23.96,22.81 23.26,22.11 v23.26,21.71
  Route15 0.2: v23.26,21.71 18.46,21.71 16.86,20.11 15.46,20.11 v14.96,19.61
  Bottom 0.2: U4.19 15.76,20.41 v14.96,19.61
ECG_CLK_32K
  Top 0.127: U$30.D5 8.06,20.46 8.06,21.24 8.08,21.26
  Top 0.2: U$29.3 8.41,27.71 SWIO1.TP | C15.1 9.96,23.46 8.08,21.58 8.08,21.26
  Top 0.254: U$29.3 9.96,27.46 C15.1
ECG_CS  (via drill 0.35)
  Top 0.152: 9.11,21.01 9.31,21.21 v10.01,21.21
  Top 0.2: U$30.E6 9.11,21.01 | J1.20 17.46,4.71 16.96,4.21 13.96,4.21 v13.36,3.61
  Top 0.254: SWIO7.TP 14.66,4.91 v13.36,3.61
  Bottom 0.2: v13.36,3.61 13.46,3.71 13.46,4.01 5.86,11.61 5.86,19.31 7.76,21.21 v10.01,21.21
ECG_VCM  (via drill 0.35, 1)
  Top 0.2: U$30.C1 7.81,14.36 8.16,14.01 v8.16,13.96
  Top 0.254: C33.1 8.66,13.46 v8.16,13.96 | R27.2 24.46,6.41 25.06,7.01 v25.06,7.31
  Route15 0.254: v8.16,13.96 4.56,10.36 4.56,9.21 5.56,8.21 7.46,8.21 12.86,13.61 19.36,13.61 20.06,12.91 22.56,12.91 25.06,10.41 v25.06,7.31
ECGN  (via drill 0.35, 1)
  Top 0.254: TP12.TP 5.86,29.01 5.86,26.91
  Top 0.305: 5.86,26.91 v5.81,26.91
  Top 0.406: R40.1 6.31,26.46 5.86,26.91
  Bottom 0.254: v15.66,36.81 15.66,35.61 6.96,26.91 v5.81,26.91
ECGP
  Top 0.254: R39.1 2.71,26.16 TP11.TP
EN
  Top 0.127: 6.41,21.11 U$30.A6
  Top 0.2: 6.41,21.11 6.01,21.51 C45.2 6.31,22.61 6.31,23.51 | R40.2 6.31,23.51 | C43.1 6.21,23.61 6.31,23.51
EP
  Top 0.2: U$30.A5 6.56,20.21 4.71,22.06 C45.1
  Top 0.254: 4.71,22.51 C45.1 4.01,23.01 R39.2 C44.1
EXT_3V3
  Top 0.152: R24.2 17.56,1.36 17.56,2.58
  Top 0.2: J1.15 J1.17 17.56,2.58 J1.19
GND  (via drill 0.35, 1)
  Top 0.127: U$30.B3 7.06,18.96 6.51,18.96 5.46,17.91
  Top 0.152: 5.46,17.91 5.16,17.91
  Top 0.2: U6.2 25.56,21.91 25.86,21.61
  Top 0.254: J1.11 19.06,3.31 v18.66,3.71 | J2.1 21.06,31.41 v22.06,30.41 | J2.2 21.06,36.41
  Bottom 0.2: U4.30 19.46,20.96 U4.24
  other vias: 4.71,17.26 10.66,14.11 8.56,31.11 4.26,29.11 15.16,25.51 34.26,19.81 28.66,27.21 23.36,27.71 14.96,10.21 10.76,2.91 28.06,2.91 23.66,5.01 21.16,11.31
  pour Top: 38.71,38.87 0.01,38.87 0.01,-0.18 38.71,-0.18
  pour Bottom: 38.61,39.01 -0.16,39.01 -0.16,-0.14 38.61,-0.14
  pour Route15: 38.76,39.01 -0.04,39.01 -0.04,-0.09 38.76,-0.09
HR_INT  (via drill 0.35)
  Top 0.2: U$3.18 30.46,22.41 v30.06,22.81 29.56,23.31 R11.2 | v17.76,37.21 18.66,36.31 J2.14
  Top 0.254: R11.2 28.33,23.86 D13.2
  Route15 0.2: v30.06,22.81 30.36,23.11 30.36,26.61 20.66,36.31 18.66,36.31 v17.76,37.21
  Bottom 0.254: JP1.2 33.46,20.21 34.06,20.81 34.06,21.51 33.66,21.91 30.96,21.91 v30.06,22.81
INT  (via drill 0.35)
  Top 0.2: v12.56,25.51 13.16,26.11 13.56,26.11
  Top 0.254: U$39.5 14.21,25.26 13.56,25.91 13.56,26.11 R22.1
  Bottom 0.2: U4.13 16.67,17.26 16.34,16.93 13.94,16.93 12.16,18.71 12.16,25.11 v12.56,25.51
INT_3V3
  Top 0.254: U9.5 23.91,35.58 C11.1 23.54,35.73 22.01,37.26 R23.2
INTB  (via drill 0.35)
  Top 0.127: U$30.D2 8.56,18.46 9.01,18.46 9.31,18.16 9.91,18.16
  Top 0.152: v10.16,17.91 9.91,18.16
  Top 0.2: J1.8 19.86,4.71 21.26,3.31 22.36,3.31 v22.66,3.01
  Bottom 0.2: v22.66,3.01 22.36,2.71 17.66,2.71 9.66,10.71 9.66,14.11 8.66,15.11 8.66,16.41 v10.16,17.91
MFIO
  Top 0.2: J1.6 20.26,4.81 21.16,3.91 24.56,3.91 28.16,7.51 28.16,11.11 28.16,12.31 30.66,14.81 30.66,17.21 30.56,17.31
  Top 0.254: 30.56,17.31 29.96,17.91 U$3.1 | R2.2 28.36,10.91 28.16,11.11
MISO  (via drill 0.35)
  Top 0.127: 9.41,18.71 8.91,19.21 U$30.E3
  Top 0.2: 9.41,18.71 10.56,18.71 v11.36,17.91 | J1.5 20.26,1.71 20.86,1.11 23.96,1.11 v25.16,2.31
  Top 0.254: SWIO2.TP 25.36,2.11 v25.16,2.31
  Bottom 0.2: v11.36,17.91 10.66,18.61 8.76,18.61 8.06,17.91 8.06,15.11 9.16,14.01 9.16,10.61 17.46,2.31 v25.16,2.31
MOSI  (via drill 0.35)
  Top 0.127: U$30.E4 9.01,19.71 9.06,19.76
  Top 0.152: 9.06,19.76 9.11,19.81 v10.26,19.81
  Top 0.2: J1.14 18.66,4.71 17.36,3.41 16.46,3.41 v15.66,2.61
  Top 0.254: SWIO3.TP 11.86,3.01 12.66,2.21 15.26,2.21 v15.66,2.61
  Route15 0.2: v10.26,19.81 10.06,20.01
  Bottom 0.2: v15.66,2.61 15.66,3.01 6.76,11.91 6.76,18.71 7.86,19.81 v10.26,19.81
N$1
  Top 0.2: U$3.12 33.26,20.91 34.56,22.21 34.56,22.91 35.46,23.81 C4.1
N$2
  Top 0.254: R8.1 C7.2
N$3
  Top 0.254: U1.4 28,30.61 R14.2
N$4
  Top 0.254: U1.2 26.96,29.01 27.16,29.21 27.86,29.21 28.85,28.23 L1.2
N$5  (via drill 0.35)
  Top 0.2: v21.26,15.91 21.26,15.71 21.86,15.11 C18.2
  Top 0.254: C18.2 21.86,13.36 U$32.P$2
  Bottom 0.2: U4.8 20.06,16.81 20.96,15.91 v21.26,15.91
N$6
  Top 0.254: R27.1 TP13.TP
N$7  (via drill 1)
  other vias: 35.06,27.31
N$8
  Bottom 0.2: U4.25 U4.26
N$9  (via drill 0.35)
  Top 0.2: C28.1 23.66,19.36 23.31,19.36 22.76,18.81 v22.76,18.11
  Bottom 0.2: v22.76,18.11 22.46,18.11 22.16,18.41 U4.5
N$10  (via drill 0.35)
  Top 0.2: v14.46,17.61 14.36,17.59 13.75,17.52 R21.1
  Bottom 0.2: U4.38 17.97,17.82 17.76,17.61 14.57,17.72 v14.46,17.61
N$11  (via drill 0.35)
  Top 0.2: v22.36,20.91 23.51,20.91 C37.2
  Bottom 0.2: U4.2 21.66,20.01 22.06,20.41 22.06,20.61 v22.36,20.91
N$12
  Top 0.254: C36.2 12.96,15.06 R25.2
N$18
  Top 0.152: C66.1 R9.2
N$19
  Top 0.254: R10.1 4.11,12.06 C63.1
N$21  (via drill 0.35)
  Top 0.2: v23.96,24.71 23.96,24.54 U6.13
  Bottom 0.254: LED1.4 22.74,25.94 v23.96,24.71
N$23  (via drill 0.35)
  Top 0.2: U6.1 25.16,22.21 24.86,21.91 v24.46,21.91
  Bottom 0.2: LED1.2 18.09,25.94 17.96,25.81 17.96,25.11 18.26,24.81 22.26,24.81 22.56,24.51
  Bottom 0.254: 22.56,24.51 24.46,22.61 v24.46,21.91
N$25
  Top 0.2: U$3.8 33.26,19.31 34.76,17.81 C6.2 36.01,17.81 U$10.P$2
N$26  (via drill 0.35)
  Top 0.2: U6.15 23.66,23.21 23.16,22.71 22.76,22.71 v22.66,22.61
  Bottom 0.2: v22.66,22.61 22.66,23.51 21.82,24.36 20.21,24.36 D3.C1 19.41,24.16 D3.C2
N$32  (via drill 1)
  other vias: 6.76,31.81
N$34  (via drill 1)
  other vias: 25.26,35.81
N$53
  Top 0.127: U$30.C6 7.81,21.91
  Top 0.2: C29.1 8.86,22.91 8.84,22.94 7.81,21.91
N$55
  Top 0.127: U$30.B5 7.06,20.46 7.06,21.51 7.01,21.56 7.01,24.31
  Top 0.2: 7.01,24.31 7.61,24.91 C26.2
N$56
  Top 0.127: U$30.D1 8.21,18.11
  Top 0.2: 8.21,18.11 8.21,14.91 10.26,12.86 C32.1
N$57
  Top 0.127: U$30.B1 7.31,18.11 7.41,18.01 7.41,12.56
  Top 0.2: C34.1 7.41,12.56 7.36,12.61
N$60
  Top 0.127: U$30.B6 7.41,20.81 7.41,22.16 7.76,22.51
  Top 0.2: 7.76,22.51 C26.1
N$61
  Top 0.127: U$30.A1 6.81,18.11 6.56,17.86
  Top 0.2: 6.56,17.86 6.56,14.66 6.06,14.16 4.71,14.16 C63.2
N$62
  Top 0.127: U$30.A2 5.76,17.66 5.76,17.16 5.26,16.66
  Top 0.2: 5.26,16.66 C66.2
N$63
  Top 0.127: U$30.A3 5.81,19.21
  Top 0.2: 5.81,19.21 5.41,18.81 C69.1 4.41,18.81 4.16,18.56 C67.1 3.96,18.36 2.51,16.91 R42.2
N$64
  Top 0.2: U$30.A4 5.46,19.71 5.21,19.96 C69.2 R43.2
  Top 0.254: C68.1 R43.2
N$65
  Top 0.127: 7.01,17.76 7.06,17.81 7.06,18.46 U$30.B2
  Top 0.2: R44.1 5.36,13.66 6.56,13.66 7.01,14.11 7.01,17.76
NO1  (via drill 0.35)
  Top 0.2: U6.11 25.56,25.91 25.46,26.01 v25.46,26.31
  Top 0.254: v16.01,14.86 16.01,18.06 15.76,18.31 15.76,19.51 16.51,20.26 v16.51,21.56
  Route15 0.2: v16.51,21.56 16.81,21.56 21.96,26.71 25.06,26.71 v25.46,26.31
  Bottom 0.2: U4.21 18.46,21.51 18.26,21.71 16.66,21.71 v16.51,21.56
  Bottom 0.254: D4.C1 19.41,15.16 D4.C2 16.16,14.71 v16.01,14.86
RESET
  Top 0.2: J1.1 21.06,2.11 21.26,1.91 23.16,1.91 28.56,7.31 | 31.16,14.51 31.16,16.51
  Top 0.254: U$3.6 32.06,17.56 C7.1 31.91,17.26 31.16,16.51 | R1.1 29.51,8.26 | 28.56,7.31 29.51,8.26 | 29.51,8.26 31.71,8.26 32.21,8.76 | 32.21,8.76 32.66,9.21 32.66,13.01 31.16,14.51 | SWIO8.TP 32.66,8.31 32.21,8.76
RESET_1  (via drill 0.35)
  Top 0.2: v22.56,4.99 22.28,4.71 21.36,4.71 21.06,5.01 J1.2
  Top 0.254: v15,15.19 14.88,15.31 C36.1 | R1.2 31.66,9.61 v31.86,9.81
  Route2 0.254: v31.86,9.81 30.46,8.41 28.86,8.41 24.66,4.21 23.34,4.21 v22.56,4.99
  Bottom 0.2: U4.10 19.26,16.71 17.76,15.21 16.76,15.21 16.43,15.54 15.36,15.54 v15,15.19 15,12.97 16.96,11.01 19.06,11.01 20.36,12.31 22.26,12.31 24.26,10.31 24.26,7.93 24.05,7.73 24.05,6.51 22.56,5.01 v22.56,4.99
  Bottom 0.254: 14.96,15.21 14.98,15.21 v15,15.19
S_SCL  (via drill 0.35)
  Top 0.2: U$3.14 32.06,22.81 v32.11,22.86 31.96,23.01 R5.2 | v22.46,35.61 21.86,35.01 18.56,35.01 18.26,35.31 J2.16
  Top 0.254: R5.2 30.83,23.86 D2.2
  Route15 0.2: v32.11,22.86 32.11,23.26 30.76,24.61 30.76,26.91 22.46,35.21 v22.46,35.61
  Bottom 0.254: JP1.4 33.56,18.21 33.86,17.91 35.16,17.91 36.06,18.81 36.06,21.01 34.26,22.81 34.26,23.21 33.66,23.81 32.86,23.81 32.11,23.06 v32.11,22.86
S_SDA  (via drill 0.35)
  Top 0.2: R6.2 33.16,22.91 v33.26,22.81 33.26,21.91 U$3.13 | v24.86,33.91 24.86,33.71 24.46,33.31 23.36,33.31 22.06,34.61 18.16,34.61 17.86,34.91 J2.18
  Top 0.254: R6.2 34.19,23.86 D1.2
  Route15 0.2: v33.26,22.81 31.16,24.91 31.16,27.21 24.86,33.51 v24.86,33.91
  Bottom 0.254: JP1.3 33.46,19.21 34.06,18.61 34.86,18.61 35.46,19.21 35.46,20.81 33.46,22.81 v33.26,22.81
SCK  (via drill 0.35)
  Top 0.2: U$30.E5 8.91,20.21 9.21,20.51 10.8,20.51 v10.96,20.67 | J1.18 17.86,4.61 17.06,3.81 15.5,3.81 v14.61,2.92
  Top 0.254: SWIO4.TP 13.26,5.51 12.36,4.61 12.36,3.31 12.86,2.81 14.5,2.81 v14.61,2.92
  Bottom 0.2: v14.61,2.92 14.51,3.02 14.51,3.56 6.36,11.71 6.36,19.01 7.86,20.51 10.8,20.51 v10.96,20.67
SCL  (via drill 0.35, 1)
  Top 0.2: U$3.24 28.56,19.31 v27.66,18.41 | J1.4 20.66,4.91 21.26,4.31 23.96,4.31 24.86,5.21
  Top 0.254: v27.66,18.41 27.11,17.86 R3.2 27.11,14.41 R13.2 27.21,7.96 v25.06,5.81 24.86,5.61 24.86,5.21
  Route15 0.254: v12.76,11.81 14.16,13.21 19.06,13.21 19.76,12.51 22.36,12.51 23.86,11.01 23.86,7.01 v25.06,5.81
  Bottom 0.2: v27.66,18.41 26.46,19.61 U4.3
SDA  (via drill 0.35, 1)
  Top 0.2: U$3.23 27.46,19.71 v26.36,18.61 26.36,16.71 25.96,16.31 24.36,16.31 23.91,15.86 23.91,15.41 | 25.06,3.21 23.36,1.51 21.06,1.51 20.66,1.91 J1.3
  Top 0.254: 23.91,15.41 R4.2 23.81,14.41 R16.2 23.91,12.96 25.96,10.91 v25.96,8.61 | 25.06,3.21 v25.86,3.21
  Route15 0.254: v12.86,9.31 16.06,12.51 18.96,12.51 19.36,12.11 21.96,12.11 23.36,10.71 23.36,6.41 25.86,3.91 v25.86,3.21
  Bottom 0.2: v26.36,18.61 26.16,18.81 U4.4
  Bottom 0.254: v25.96,8.61 26.06,8.61 26.26,8.41 26.26,3.61 v25.86,3.21
SDI  (via drill 0.35)
  Top 0.2: U$39.2 15.21,23.76 15.56,23.41 15.56,22.61 15.36,22.41 15.16,22.41 14.46,21.71 v14.26,21.71
  Route15 0.2: v14.26,21.71 12.86,21.71 12.66,21.51 12.66,20.41 15.36,17.71 19.06,17.71 19.36,18.01 19.36,19.31 v19.46,19.41
  Bottom 0.2: U4.36 19.06,18.21 19.46,18.61 v19.46,19.41
SDO  (via drill 0.35)
  Top 0.2: U$39.1 14.72,22.77 14.36,22.41 13.96,22.41 13.56,22.01 v13.56,20.81
  Route15 0.2: v13.56,20.81 13.56,20.01 15.36,18.21 18.06,18.21 v18.46,18.61
  Bottom 0.2: U4.37 18.66,18.41 v18.46,18.61
SEN_CS  (via drill 0.35)
  Top 0.2: v14.95,16.2 15.25,16.5 15.25,18.13 12.2,21.17 12.2,22.66 12.8,23.26 U$39.10
  Bottom 0.2: U4.11 18.86,16.81 17.66,15.61 16.86,15.61 16.27,16.2 v14.95,16.2
SEN_SCK  (via drill 0.35)
  Top 0.2: U$39.12 14.21,23.06 13.86,22.71 13.16,22.71 12.96,22.51 v12.96,22.41
  Route15 0.2: v12.96,22.41 12.86,22.41 12.16,21.71 12.16,20.21 13.46,18.91 13.46,17.41 13.96,16.91 16.36,16.91 16.76,17.31 19.36,17.31 20.16,18.11 v20.16,18.61
  Bottom 0.2: U4.35 19.46,18.11 19.96,18.61 v20.16,18.61
VBAT
  Top 0.2: 18.06,34.21 18.26,34.01 J2.15 J2.13
  Top 0.254: C19.1 12.91,35.51 U$6.3 12.91,32.86 13.26,32.51 14.46,32.51 14.81,32.86 U$6.1 15.33,34.21 18.06,34.21 21.66,34.21 22.46,33.41 22.46,31.81 22.66,31.61 U9.1 23.91,32.36 24.26,32.71 25.36,32.71 25.81,32.26 25.81,31.71 | L1.1 30.45,31.51 27.36,31.51 26.96,31.11 U1.5 U1.6 | U1.6 25.13,30.22 C10.1 25.01,30.01 | U1.6 25.81,30.72 U9.3 25.81,31.71 | C12.1 26.36,31.71 25.81,31.71 | J2.11 J2.13
VPP  (via drill 0.35)
  Top 0.2: C39.1 20.01,31.56 19.36,32.21 18.16,32.21 17.86,32.51 17.86,32.91 | U6.10 25.96,25.71 26.26,26.01 v26.26,27.11 | 17.86,32.91 J2.17 | J2.19 17.79,32.98 17.86,32.91
  Top 0.254: v18.56,11.71 C48.1 C42.1 17.01,14.91 16.56,15.36 v16.56,18.91 | U1.1 26.26,28.4 | 26.26,28.4 25.32,28.4 C9.1 | v26.26,27.11 26.26,28.4 | v21.46,23.61 21.16,23.31 20.01,23.31
  Top 0.406: C39.1 C38.1 20.11,28.91 20.11,27.41 20.01,27.31 C41.1 | C9.1 22.61,28.76 v21.26,27.41 20.31,27.41 C41.1 | C41.1 C40.1 C27.1 20.01,23.31 20.01,23.06 16.56,19.61 v16.56,18.91
  Bottom 0.2: U4.18 16.81,20.01 16.56,19.76 v16.56,18.91 | LED1.3 19.49,25.49 19.26,25.71 19.26,26.51 20.16,27.41 v21.26,27.41
  Bottom 0.254: D4.A 20.01,13.36 18.56,11.91 v18.56,11.71 | JP1.1 30.56,21.21 26.36,25.41 26.36,27.01 v26.26,27.11 | D3.A 21.02,23.27 21.36,23.61 v21.46,23.61
W_MFIO  (via drill 0.35)
  Top 0.2: J1.10 19.46,4.01 v19.76,3.71 v19.77,3.71
  Top 0.254: R2.1 30.81,11.66 30.26,12.21 | 30.26,12.21 v30.16,12.21 | SWIO9.TP 30.66,12.61 30.26,12.21
  Route2 0.2: v19.77,3.71 19.87,3.81 25.06,3.81 28.26,7.01 | 28.06,17.41 28.76,18.11 v28.86,18.11
  Route2 0.254: 28.26,7.01 29.06,7.81 31.36,7.81 32.76,9.21 32.76,11.11 31.66,12.21 v30.16,12.21 28.06,14.31 28.06,17.41
  Route15 0.2: v17.36,16.51 17.56,16.71 27.46,16.71 v28.86,18.11
  Bottom 0.2: U4.12 18.46,16.91 18.06,16.51 v17.36,16.51

### Text on the board
tPlace: ECG_N | ECG_P | CLK | pc_healthypi_move | Sensor Dual | MFIO | 1.8V | BAIZP | SCL | RESET | SDA | VCM | BIASN | BAIZP | SCK | CS | v2 | MOSI | MISO | 04/24 | 3V3
bPlace: pc_healthypi_move | protocentral.com | v2 | 04/24